# Altium schematic sheet Mcu.SchDoc
size B; Date: 2021/11/8; SheetNumber: 1; SheetTotal: 8
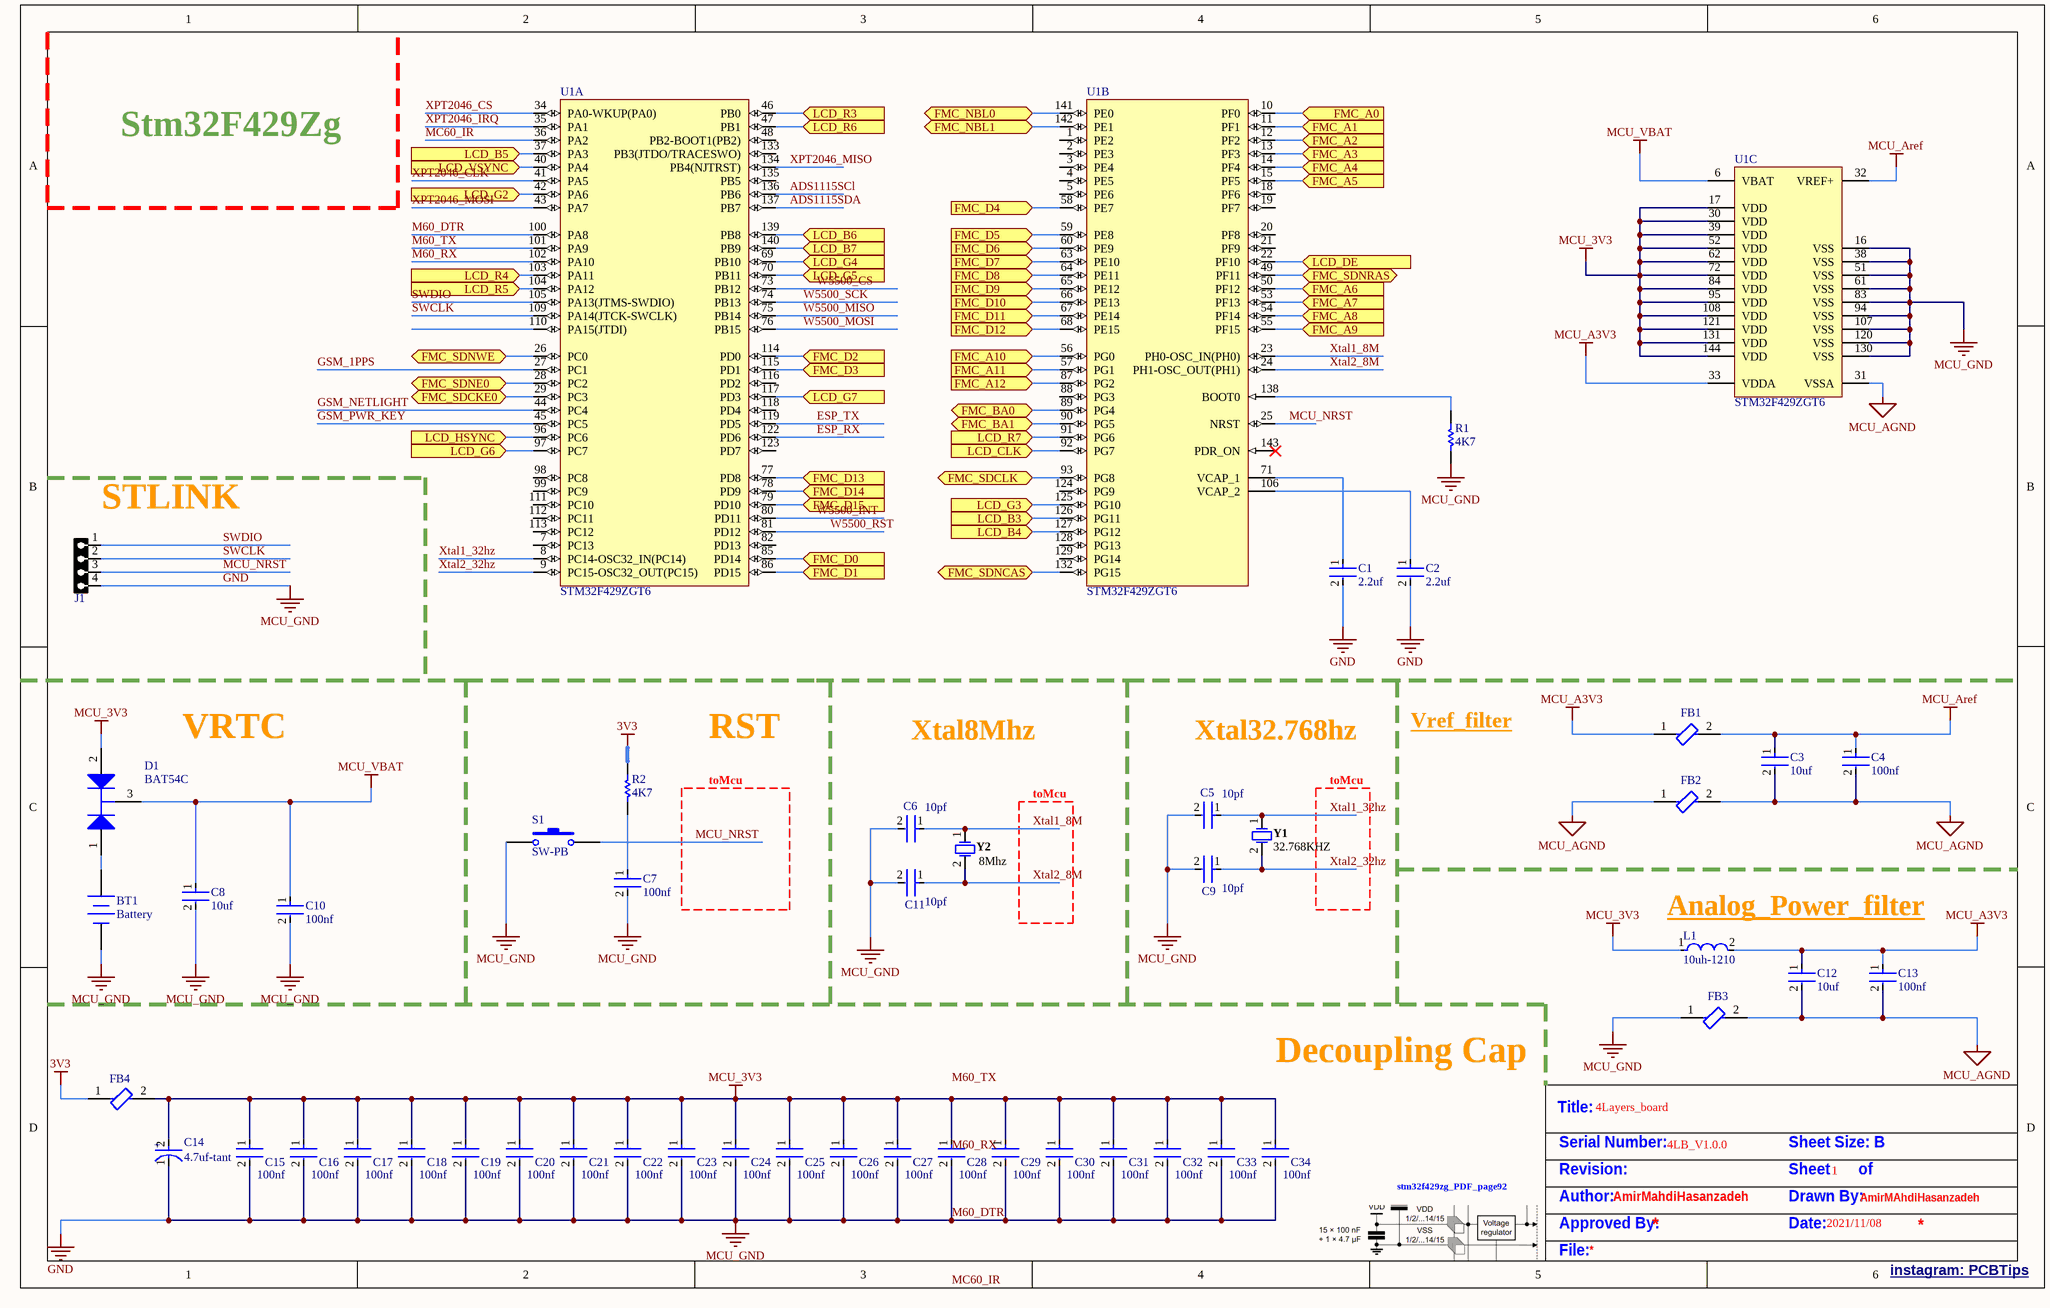
[diagram p0: Mcu.SchDoc]

## Parts
BT1  Battery  [BTH1220]
C1  2.2uf  [FP-C3216-160-0_2-IPC_A]
C2  2.2uf  [FP-C3216-160-0_2-IPC_A]
C3  10uf  [FP-C3216-160-0_2-IPC_A]
C4  100nf  [FP-CGA3E-0_3-0_1-IPC_A]
C5  10pf  [FP-CGA3E-0_3-0_1-IPC_A]
C6  10pf  [FP-CGA3E-0_3-0_1-IPC_A]
C7  100nf  [FP-CGA3E-0_3-0_1-IPC_A]
C8  10uf  [FP-C3216-160-0_2-IPC_A]
C9  10pf  [FP-CGA3E-0_3-0_1-IPC_A]
C10  100nf  [FP-CGA3E-0_3-0_1-IPC_A]
C11  10pf  [FP-CGA3E-0_3-0_1-IPC_A]
C12  10uf  [FP-C3216-160-0_2-IPC_A]
C13  100nf  [FP-CGA3E-0_3-0_1-IPC_A]
C14  4.7uf-tant  [FP-T491A475K016AT-MFG]
C15  100nf  [FP-CGA3E-0_3-0_1-IPC_A]
C16  100nf  [FP-CGA3E-0_3-0_1-IPC_A]
C17  100nf  [FP-CGA3E-0_3-0_1-IPC_A]
C18  100nf  [FP-CGA3E-0_3-0_1-IPC_A]
C19  100nf  [FP-CGA3E-0_3-0_1-IPC_A]
C20  100nf  [FP-CGA3E-0_3-0_1-IPC_A]
C21  100nf  [FP-CGA3E-0_3-0_1-IPC_A]
C22  100nf  [FP-CGA3E-0_3-0_1-IPC_A]
C23  100nf  [FP-CGA3E-0_3-0_1-IPC_A]
C24  100nf  [FP-CGA3E-0_3-0_1-IPC_A]
C25  100nf  [FP-CGA3E-0_3-0_1-IPC_A]
C26  100nf  [FP-CGA3E-0_3-0_1-IPC_A]
C27  100nf  [FP-CGA3E-0_3-0_1-IPC_A]
C28  100nf  [FP-CGA3E-0_3-0_1-IPC_A]
C29  100nf  [FP-CGA3E-0_3-0_1-IPC_A]
C30  100nf  [FP-CGA3E-0_3-0_1-IPC_A]
C31  100nf  [FP-CGA3E-0_3-0_1-IPC_A]
C32  100nf  [FP-CGA3E-0_3-0_1-IPC_A]
C33  100nf  [FP-CGA3E-0_3-0_1-IPC_A]
C34  100nf  [FP-CGA3E-0_3-0_1-IPC_A]
D1  BAT54C  [ONSC-SOT-323-3-419-04_V]
FB1  MMZ1608R600ATA00  [FP-MMZ1608-0_8-MFG]  (value not drawn)
FB2  MMZ1608R600ATA00  [FP-MMZ1608-0_8-MFG]  (value not drawn)
FB3  MMZ1608R600ATA00  [FP-MMZ1608-0_8-MFG]  (value not drawn)
FB4  MMZ1608R600ATA00  [FP-MMZ1608-0_8-MFG]  (value not drawn)
J1  HDRF4  [HDR_F_1X4]  (value not drawn)
L1  10uh-1210  [FP-CB3225-IPC_A]
R1  4K7  [RESC1608X55X25ML10T15]
R2  4K7  [RESC1608X55X25ML10T15]
S1  SW-PB  [SWPBS_SPST_6X3X5]
U1  STM32F429ZGT6  [STM-LQFP144_V]  (parts A,B,C of 3)
Y1  32.768KHZ  [ABRA-AB26T]
Y2  8Mhz  [FOX-HC49SDLF_V]

## Ports
FMC_A0 (in), FMC_A1 (in), FMC_A2 (in), FMC_A3 (in), FMC_A4 (in), FMC_A5 (in), FMC_A6 (in), FMC_A7 (in), FMC_A8 (in), FMC_A9 (in), FMC_A10 (in), FMC_A11 (in), FMC_A12 (in), FMC_BA0 (bidir), FMC_BA1 (bidir), FMC_D0 (in), FMC_D1 (in), FMC_D2 (in), FMC_D3 (in), FMC_D4 (in), FMC_D5 (in), FMC_D6 (in), FMC_D7 (in), FMC_D8 (in), FMC_D9 (in), FMC_D10 (in), FMC_D11 (in), FMC_D12 (in), FMC_D13 (in), FMC_D14 (in), FMC_D15 (in), FMC_NBL0 (bidir), FMC_NBL1 (bidir), FMC_SDCKE0 (bidir), FMC_SDCLK (bidir), FMC_SDNCAS (bidir), FMC_SDNE0 (bidir), FMC_SDNRAS (bidir), FMC_SDNWE (bidir), LCD_B3 (in), LCD_B4 (in), LCD_B5 (in), LCD_B6 (in), LCD_B7 (in), LCD_CLK (in), LCD_DE (in), LCD_G2 (in), LCD_G3 (in), LCD_G4 (in), LCD_G5 (in), LCD_G6 (in), LCD_G7 (in), LCD_HSYNC (in), LCD_R3 (in), LCD_R4 (in), LCD_R5 (in), LCD_R6 (in), LCD_R7 (in), LCD_VSYNC (in)

## Nets
3V3: FB4.1 R2.2
GND: BT1.2(-) C1.2 C2.2 C5.2 C6.2 C7.2 C8.2 C9.2 C10.2 C11.2 C14.1(C) C15.2 C16.2 C17.2 C18.2 C19.2 C20.2 C21.2 C22.2 C23.2 C24.2 C25.2 C26.2 C27.2 C28.2 C29.2 C30.2 C31.2 C32.2 C33.2 C34.2 FB3.1 J1.4 R1.1 S1.2 U1.16(VSS) U1.38(VSS) U1.51(VSS) U1.61(VSS) U1.83(VSS) U1.94(VSS) U1.100(PA8) U1.107(VSS) U1.120(VSS) U1.130(VSS)  [also labelled M60_DTR, MCU_GND]
MCU_3V3: C14.2(A) C15.1 C16.1 C17.1 C18.1 C19.1 C20.1 C21.1 C22.1 C23.1 C24.1 C25.1 C26.1 C27.1 C28.1 C29.1 C30.1 C31.1 C32.1 C33.1 C34.1 D1.2(A2) FB4.2 L1.1 U1.17(VDD) U1.30(VDD) U1.39(VDD) U1.52(VDD) U1.62(VDD) U1.72(VDD) U1.84(VDD) U1.95(VDD) U1.108(VDD) U1.121(VDD) U1.131(VDD) U1.144(VDD)
MCU_A3V3: C12.1 C13.1 FB1.1 L1.2 U1.33(VDDA)
MCU_AGND: C3.2 C4.2 C12.2 C13.2 FB2.1 FB2.2 FB3.2 U1.31(VSSA)
MCU_Aref: C3.1 C4.1 FB1.2 U1.32(VREF+)
MCU_VBAT: C8.1 C10.1 D1.3(K) U1.6(VBAT)
ADS1115SCl: U1.136(PB6)
ADS1115SDA: U1.137(PB7)
ESP_RX: U1.122(PD6)
ESP_TX: U1.119(PD5)
FMC_A0: U1.10(PF0) ; port FMC_A0
FMC_A1: U1.11(PF1) ; port FMC_A1
FMC_A2: U1.12(PF2) ; port FMC_A2
FMC_A3: U1.13(PF3) ; port FMC_A3
FMC_A4: U1.14(PF4) ; port FMC_A4
FMC_A5: U1.15(PF5) ; port FMC_A5
FMC_A6: U1.50(PF12) ; port FMC_A6
FMC_A7: U1.53(PF13) ; port FMC_A7
FMC_A8: U1.54(PF14) ; port FMC_A8
FMC_A9: U1.55(PF15) ; port FMC_A9
FMC_A10: U1.56(PG0) ; port FMC_A10
FMC_A11: U1.57(PG1) ; port FMC_A11
FMC_A12: U1.87(PG2) ; port FMC_A12
FMC_BA0: U1.89(PG4) ; port FMC_BA0
FMC_BA1: U1.90(PG5) ; port FMC_BA1
FMC_D0: U1.85(PD14) ; port FMC_D0
FMC_D1: U1.86(PD15) ; port FMC_D1
FMC_D2: U1.114(PD0) ; port FMC_D2
FMC_D3: U1.115(PD1) ; port FMC_D3
FMC_D4: U1.58(PE7) ; port FMC_D4
FMC_D5: U1.59(PE8) ; port FMC_D5
FMC_D6: U1.60(PE9) ; port FMC_D6
FMC_D7: U1.63(PE10) ; port FMC_D7
FMC_D8: U1.64(PE11) ; port FMC_D8
FMC_D9: U1.65(PE12) ; port FMC_D9
FMC_D10: U1.66(PE13) ; port FMC_D10
FMC_D11: U1.67(PE14) ; port FMC_D11
FMC_D12: U1.68(PE15) ; port FMC_D12
FMC_D13: U1.77(PD8) ; port FMC_D13
FMC_D14: U1.78(PD9) ; port FMC_D14
FMC_D15: U1.79(PD10) ; port FMC_D15
FMC_NBL0: U1.141(PE0) ; port FMC_NBL0
FMC_NBL1: U1.142(PE1) ; port FMC_NBL1
FMC_SDCKE0: U1.29(PC3) ; port FMC_SDCKE0
FMC_SDCLK: U1.93(PG8) ; port FMC_SDCLK
FMC_SDNCAS: U1.132(PG15) ; port FMC_SDNCAS
FMC_SDNE0: U1.28(PC2) ; port FMC_SDNE0
FMC_SDNRAS: U1.49(PF11) ; port FMC_SDNRAS
FMC_SDNWE: U1.26(PC0) ; port FMC_SDNWE
GSM_1PPS: U1.27(PC1)
GSM_NETLIGHT: U1.44(PC4)
GSM_PWR_KEY: U1.45(PC5)
LCD_B3: U1.126(PG11) ; port LCD_B3
LCD_B4: U1.127(PG12) ; port LCD_B4
LCD_B5: U1.37(PA3) ; port LCD_B5
LCD_B6: U1.139(PB8) ; port LCD_B6
LCD_B7: U1.140(PB9) ; port LCD_B7
LCD_CLK: U1.92(PG7) ; port LCD_CLK
LCD_DE: U1.22(PF10) ; port LCD_DE
LCD_G2: U1.42(PA6) ; port LCD_G2
LCD_G3: U1.125(PG10) ; port LCD_G3
LCD_G4: U1.69(PB10) ; port LCD_G4
LCD_G5: U1.70(PB11) ; port LCD_G5
LCD_G6: U1.97(PC7) ; port LCD_G6
LCD_G7: U1.117(PD3) ; port LCD_G7
LCD_HSYNC: U1.96(PC6) ; port LCD_HSYNC
LCD_R3: U1.46(PB0) ; port LCD_R3
LCD_R4: U1.103(PA11) ; port LCD_R4
LCD_R5: U1.104(PA12) ; port LCD_R5
LCD_R6: U1.47(PB1) ; port LCD_R6
LCD_R7: U1.91(PG6) ; port LCD_R7
LCD_VSYNC: U1.40(PA4) ; port LCD_VSYNC
M60_RX: U1.102(PA10)
M60_TX: U1.101(PA9)
MC60_IR: U1.36(PA2)
MCU_NRST: J1.3 S1.1 U1.25(NRST)
SWCLK: J1.2 U1.109(PA14(JTCK-SWCLK))
SWDIO: J1.1 U1.105(PA13(JTMS-SWDIO))
W5500_CS: U1.73(PB12)
W5500_INT: U1.80(PD11)
W5500_MISO: U1.75(PB14)
W5500_MOSI: U1.76(PB15)
W5500_RST: U1.81(PD12)
W5500_SCK: U1.74(PB13)
XPT2046_CLK: U1.41(PA5)
XPT2046_CS: U1.34(PA0-WKUP(PA0))
XPT2046_IRQ: U1.35(PA1)
XPT2046_MISO: U1.134(PB4(NJTRST))
XPT2046_MOSI: U1.43(PA7)
Xtal1_8M: C6.1 U1.23(PH0-OSC_IN(PH0)) Y2.1
Xtal1_32hz: C5.1 U1.8(PC14-OSC32_IN(PC14)) Y1.1
Xtal2_8M: C11.1 U1.24(PH1-OSC_OUT(PH1)) Y2.2
Xtal2_32hz: C9.1 U1.9(PC15-OSC32_OUT(PC15)) Y1.2
NetBT1_1: BT1.1(+) D1.1(A1)
NetC1_1: C1.1 U1.71(VCAP_1)
NetC2_1: C2.1 U1.106(VCAP_2)
NetC7_1: C7.1 R2.1
NetR1_2: R1.2 U1.138(BOOT0)

Not connected (* = marked no-connect by the designer): U1 1(PE2) 2(PE3) 3(PE4) 4(PE5) 5(PE6) 7(PC13) 18(PF6) 19(PF7) 20(PF8) 21(PF9) 48(PB2-BOOT1(PB2)) 82(PD13) 88(PG3) 98(PC8) 99(PC9) 110(PA15(JTDI)) 111(PC10) 112(PC11) 113(PC12) 116(PD2) 118(PD4) 123(PD7) 124(PG9) 128(PG13) 129(PG14) 133(PB3(JTDO/TRACESWO)) 135(PB5) 143(PDR_ON)*

## Notes on the sheet
- Stm32F429Zg
- (near J1) STLINK
- VRTC
- RST
- Xtal8Mhz
- Xtal32.768hz
- Vref_filter
- toMcu
- (near L1) Analog_Power_filter
- Decoupling Cap
- stm32f429zg_PDF_page92
- Labels drawn without touching a wire or pin: M60_RX, M60_TX, MC60_IR
- Title:
- 4Layers_board
- Serial Number:
- Revision:
- 4LB_V1.0.0
- Sheet       of
- Sheet Size: B
- 1
- Author:
- Approved By:
- AmirMahdiHasanzadeh
- Date:
- Drawn By:
- 2021/11/08
- AmirMAhdiHasanzadeh
- File:
- instagram: PCBTips <https://www.instagram.com/pcbtips>
- (in symbol CMP-2000-07188-2) +

## Library data of the parts
BT1 = Battery: Multicell Battery; Published: 24-Mar-1999; LatestRevisionDate: 17-Jul-2002; LatestRevisionNote: Re-released for DXP Platform.; PackageReference: BAT-2; Publisher: Altium Limited; PackageDescription: Battery; 2 Leads
C1-C3 C8 C12 = CMP-2000-06045-2: Multilayer Ceramic Capacitors 10uF ±10% 50V X5R SMD 1206; Min Operating Temperature: -55°C; Weight: 0.000571oz; Tolerance: 10%; Lead Free: Lead Free; REACH SVHC: No SVHC; Dielectric Material: Ceramic; Termination: SMD/SMT; Radiation Hardening: No; Case Code (Metric): 3216; Max Operating Temperature: 85°C; Voltage Rating (DC): 50V; Packaging: Tape and Reel; Height: 1.6mm; Voltage: 50V; Dielectric: X5R; Mount: Surface Mount; Voltage Rating: 50V; Capacitance: 10uF; Length: 3.2mm; RoHS Compliant: Yes; Thickness: 0.071inch; Depth: 1.6mm; Width: 0.063inch; Case/Package: 1206; Series: C; Package Quantity: 1; Resistor Type: Ceramic; Case Code (Imperial): 1206; Construction: Flat
C4-C7 C9-C11 C13 C15-C34 = CMP-2000-07546-2: Cap Ceramic 100nF 50V X7R 10% Pad SMD 0603 +125°C Automotive T/R; Weight: 7.1E-05oz; Composition: Ceramic; Max Operating Temperature: 125°C; Termination: SMD/SMT; Dielectric: X7R; Length: 1.6mm; Package Quantity: 1; REACH SVHC: No SVHC; Lead Free: Lead Free; Case Code (Metric): 1608; Min Operating Temperature: -55°C; Packaging: Tape and Reel; Tolerance: 10%; Voltage Rating: 50V; Case Code (Imperial): 0603; Capacitance: 100nF; Case/Package: 0603; Voltage Rating (DC): 50V; Depth: 0.8mm; Radiation Hardening: No; Ratings: AEC-Q200; Mount: Surface Mount; Voltage: 50V; Thickness: 0.035inch; Width: 0.8mm; Height: 0.8mm
C14 = CMP-2000-07188-2: CAP TANT 4.7UF 10% 16V 1206; Polarity: Polar; Life (Hours): 2000Hour; Ripple Current: 137mA; ESR (Equivalent Series Resistance): 4R; Dielectric Material: Tantalum; Leakage Current: 800nA; Dissipation Factor: 6%; Voltage Rating: 16V; Case Code (Imperial): 1206; Radiation Hardening: No; Width: 1.6mm; Case/Package: 1206; Mount: Surface Mount; Voltage Rating (DC): 16V; Max Operating Temperature: 125°C; Case Code (Metric): 3216; Features: General Purpose; Number of Pins: 2; Depth: 1.6mm; Length: 3.2mm; Package Quantity: 1; Termination: SMD/SMT; Construction: Flat; Height: 1.6mm; RoHS Compliant: Yes; Tolerance: 10%; Min Operating Temperature: -55°C; Packaging: Tape and Reel; Capacitance: 4.7uF; Lead Free: Lead Free; Series: T491; REACH SVHC: No SVHC; Height - Seated (Max): 0.071inch; Voltage: 16V
D1 = CMP-1055-00561-1: Dual Series Cathode Schottky Barrier Diodes, 3-Pin SOT-323, Pb-Free, Tape and Reel; Manufacturer: On Semiconductor; PartNumber: SBAT54CWT1G; trr Max (ns): 5; IFSM Max (A): 0.6; Configuration: Common Cathode; PackageReference: SOT-323-3-419-04; Mounting Technology: Surface Mount; DatasheetVersion: Rev. 7; Packing: Tape and Reel; ComponentLink3Description: Package Specification; ComponentLink2URL: http://www.onsemi.cn/pub_link/Collateral/BAT54CWT1-D.PDF; RoHS: TRUE; ComponentLink3URL: http://www.onsemi.com/pub_link/Collateral/419-04.PDF; PackageVersion: Rev. N, 11/2008; PackageDescription: 3-Pin Small Outline Transistor, Body 2 x 1.25 mm, Pitch 0.65 mm; ComponentLink1Description: Manufacturer URL; ComponentLink2Description: Datasheet; ComponentLink1URL: http://www.onsemi.com/
FB1-FB4 = CMP-08257-000150-1: Signal Line Ferrite Bead 60Ω  @ 100MHz 800mA DCR 100mΩ SMD 0603; DC Resistance (DCR): 100mR; Tolerance: 25%; Impedance: 60R; Width: 0.031inch; Mount: Surface Mount; Max DC Current: 800mA; Series: MMZ; RoHS Compliant: Yes; Package Quantity: 1; Current Rating: 800mA; Depth: 0.8mm; Case Code (Imperial): 0603; Length: 0.063inch; Case Code (Metric): 1608; Height: 0.037inch; Core Material: Ferrite; REACH SVHC: No SVHC; Case/Package: 0603; Packaging: Cut Tape
J1 = HDR_F_1X4: CONN, HEADER, Female, pitch: 2.54mm, 4POS; VALUE: HDRF4
L1 = CMP-14484-000123-1: SMD Inductors 10uH ±20% 0.9A 0.1729Ω 1210; Shielding: Unshielded; DC Resistance (DCR): 172.9mR; Core Material: Ferrite; Self Resonant Frequency: 23MHz; Max DC Current: 900mA; Test Frequency: 100kHz; Package Quantity: 1000; Military Standard: Not; Inductance: 10uH; Height: 2.5mm; Case Code (Metric): 3225; Width: 0.098inch; Case Code (Imperial): 1210; Inductance Tolerance: 20%; Lead Free: Lead Free; Length: 3.4mm; Max Operating Temperature: 105°C; Resistor Type: Wirewound; Height - Seated (Max): 0.106inch; Series: CB; Packaging: Tape and Reel; Depth: 2.7mm; Number of Pins: 2; Radiation Hardening: No; Tolerance: 20%; Case/Package: 1210; Mount: Surface Mount; Saturation Current: 900mA; Min Operating Temperature: -40°C; DC Current: 900mA; Current Rating: 900mA; Halogen Free: Halogen Free; Termination: SMD/SMT
R1 R2 = CMP-2100-03667-1: Chip Resistor, 0 Ohm, +/- 5%, 0.1 W, -55 to 155 degC, 0603 (1608 Metric), RoHS, Tape and Reel; Manufacturer: Yageo; Temperature Coefficient: 200ppm/degreesC; Voltage Rating: 50V; Power Rating: 100mW; Resistance: 0mOhm; Width: 0.8mm; Max Operating Temperature: 155degC; Tolerance: 5%; Package Reference: 0603; Height: 0.45mm; Depth: 0.8mm; Package Description: 2-Pin Surface Mount Device, Body 1.6 x 0.8 mm; Termination: SMD/SMT; Package Quantity: 5000; Case/Package: 0603; Case Code (Imperial): 0603; Radiation Hardening: No; Number of Pins: 2; Length: 1.6mm; Lead Free: LeadFree; Voltage Rating (DC): 50V; Military Standard: Not; Datasheet URL: http://www.yageo.com/NewPortal/yageodocoutput?fileName=/pdf/R-Chip/PYu-RC_Group_51_RoHS_L_5.pdf; Manufacturer URL: http://www.yageo.com/; Packaging: TapeandReel; Case Code (Metric): 1608; Min Operating Temperature: -55degC; Composition: ThickFilm; RoHSCompliant: true; Contact Plating: Tin; Datasheet Version: Rev. 5, 10/2016; REACH SVHC: NoSVHC
S1 = SW-PB: Switch; Published: 24-Mar-1999; LatestRevisionDate: 17-Jul-2002; LatestRevisionNote: Re-released for DXP Platform.; PackageReference: SPST-2; Publisher: Altium Limited; PackageDescription: Switch; 2 Leads
U1 = CMP-0243-00052-2: ARM Cortex-M4 32-bit MCU+FPU, 225 DMIPS, 1024 kB Flash, 256 kB Internal RAM, 114 I/Os, 144-pin LQFP, -40 to 85 degC, Tray; Manufacturer: STMicroelectronics; Internal RAM Size (kB): 256; D/A Converter: 2x12-bit; FLASH Size (Prog) (kB): 1024; Supply Voltage(Vcc) min (V): 1.8; Supply Voltage(Vcc) max (V): 3.6; Operating Frequency(F) (Processor speed) (MHz): 180; I/Os (High Current): 114; PackageDescription: 144-Pin Low Profile Quad Flat Package, 20 x 20 mm Body, 0.5 mm Pitch; ComponentLink2Description: Datasheet; PartNumber: STM32F429ZGT6; PackageVersion: Rev. 4, 06/2013; ComponentLink3Description: Package Specification; ComponentLink1URL: http://www.st.com/web/en/home.html; ComponentLink2URL: http://www.st.com/st-web-ui/static/active/en/resource/technical/document/data_brief/DM00053488.pdf; DatasheetVersion: Rev. 2; ComponentLink1Description: Manufacturer URL; Mounting Technology: Surface Mount; PackageReference: LQFP144; ComponentLink3URL: http://www.st.com/st-web-ui/static/active/en/resource/technical/document/datasheet/DM00037051.pdf; Core: ARM Cortex-M4; Packing: Tray
Y1 = CMP-2000-05723-1: Crystal, 12.5 pF, 32.768 KHz, -10 to 60 degC, 2-Pin THD, RoHS, Bulk; Manufacturer: ABRACON; ESR: 35kOhms; Frequency Stability: -0.034PPM; Load Capacitance: 12.5pF; Tolerance: 20PPM; Case Length: 6.2mm; Case Diameter: 2.1mm; RoHS: Details; Product Category: Crystals; Type: WatchCrystal; Manufacturer URL: http://www.abracon.com/; Operating Temperature Range: -10Cto+60C; Package Description: 2-Pin Through Hole Device, Dia 2.1 mm, Body Length 6.2 mm; Termination Style: Radial; Datasheet Version: 06/2010; Datasheet URL: http://www.abracon.com/Resonators/AB26T.pdf; Packaging: Bulk; Factory Pack Quantity: 500; Brand: ABRACON; Mounting Technology: ThroughHole; Package URL: http://www.abracon.com/Support/PackageDrawing/Resonators/AB26T.PDF; Package / Case: Cylinder; Lead Spacing: 0.8mm; Dimensions: 2.1mmDia.x6.2mmL; Mounting Style: ThroughHole; Frequency: 32.768kHz; Package Reference: AB26T; Series: AB26T
Y2 = CMP-2100-03639-1: Resistance Weld Crystal, 8 MHz, +/- 30 ppm, -20 to 70 degC, 2-Pin SMD, RoHS, Tape and Reel; Manufacturer: FOX Electronics; Series Resistance: 80Ohm; Load Capacitance: 20pF; Tolerance: 50ppm; Frequency Tolerance: 30ppm; Datasheet URL: http://www.foxonline.com/pdfs/hc49sdlf.pdf; Package Reference: HC49SDLF; Height: 4.5mm; Mount: SurfaceMount; Packaging: TapeandReel; Length: 11.7mm; Termination: SMD/SMT; Number of Pins: 2; Depth: 5mm; Frequency: 8MHz; Min Operating Temperature: -20degC; Package Quantity: 1000; RoHSCompliant: True; Lead Free: LeadFree; Width: 5mm; Case/Package: SMD/SMT; Manufacturer URL: http://www.foxonline.com/; Max Operating Temperature: 70degC; REACH SVHC: NoSVHC; Datasheet Version: 42064.0; Package Description: 2-Pin Surface Mount Device, Body 5 x 11.7 mm; Frequency Stability: 50ppm; ESR (Equivalent Series Resistance): 80Ohm; Radiation Hardening: No